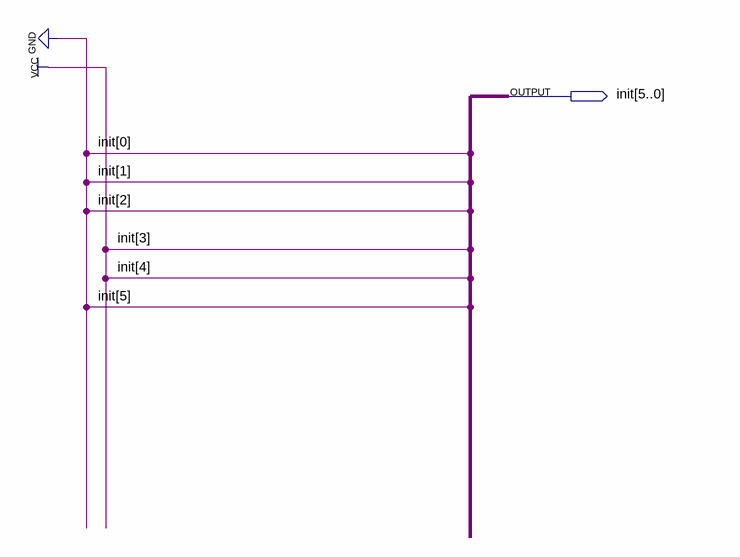
[diagram p0: schematic sheet]
// Quartus schematic InitialAddress.bdf as structural Verilog: 0 symbols, 1 pins
module InitialAddress (
  output [5:0] init
);


  assign init = 6'b011000;
endmodule
